# Altium schematic sheet SoM.SchDoc
size A3; DocumentNumber: 4; SheetNumber: 4; SheetTotal: 6; PageSetup: Record=PageOptions|CenterHorizontal=True|CenterVertical=True|PrintScale=0.97|XCorrection=1.00|YCorrection=1.00|PrintKind=1|BorderSize=5000000|LeftOffset=0|BottomOffset=0|Orientation=2|PaperLength=2970|PaperWidth=2100|Scale=100|PaperSource=7|PrintQuality=600|MediaType=1|DitherType=10|PaperKind=A4|PrintScaleMode=1
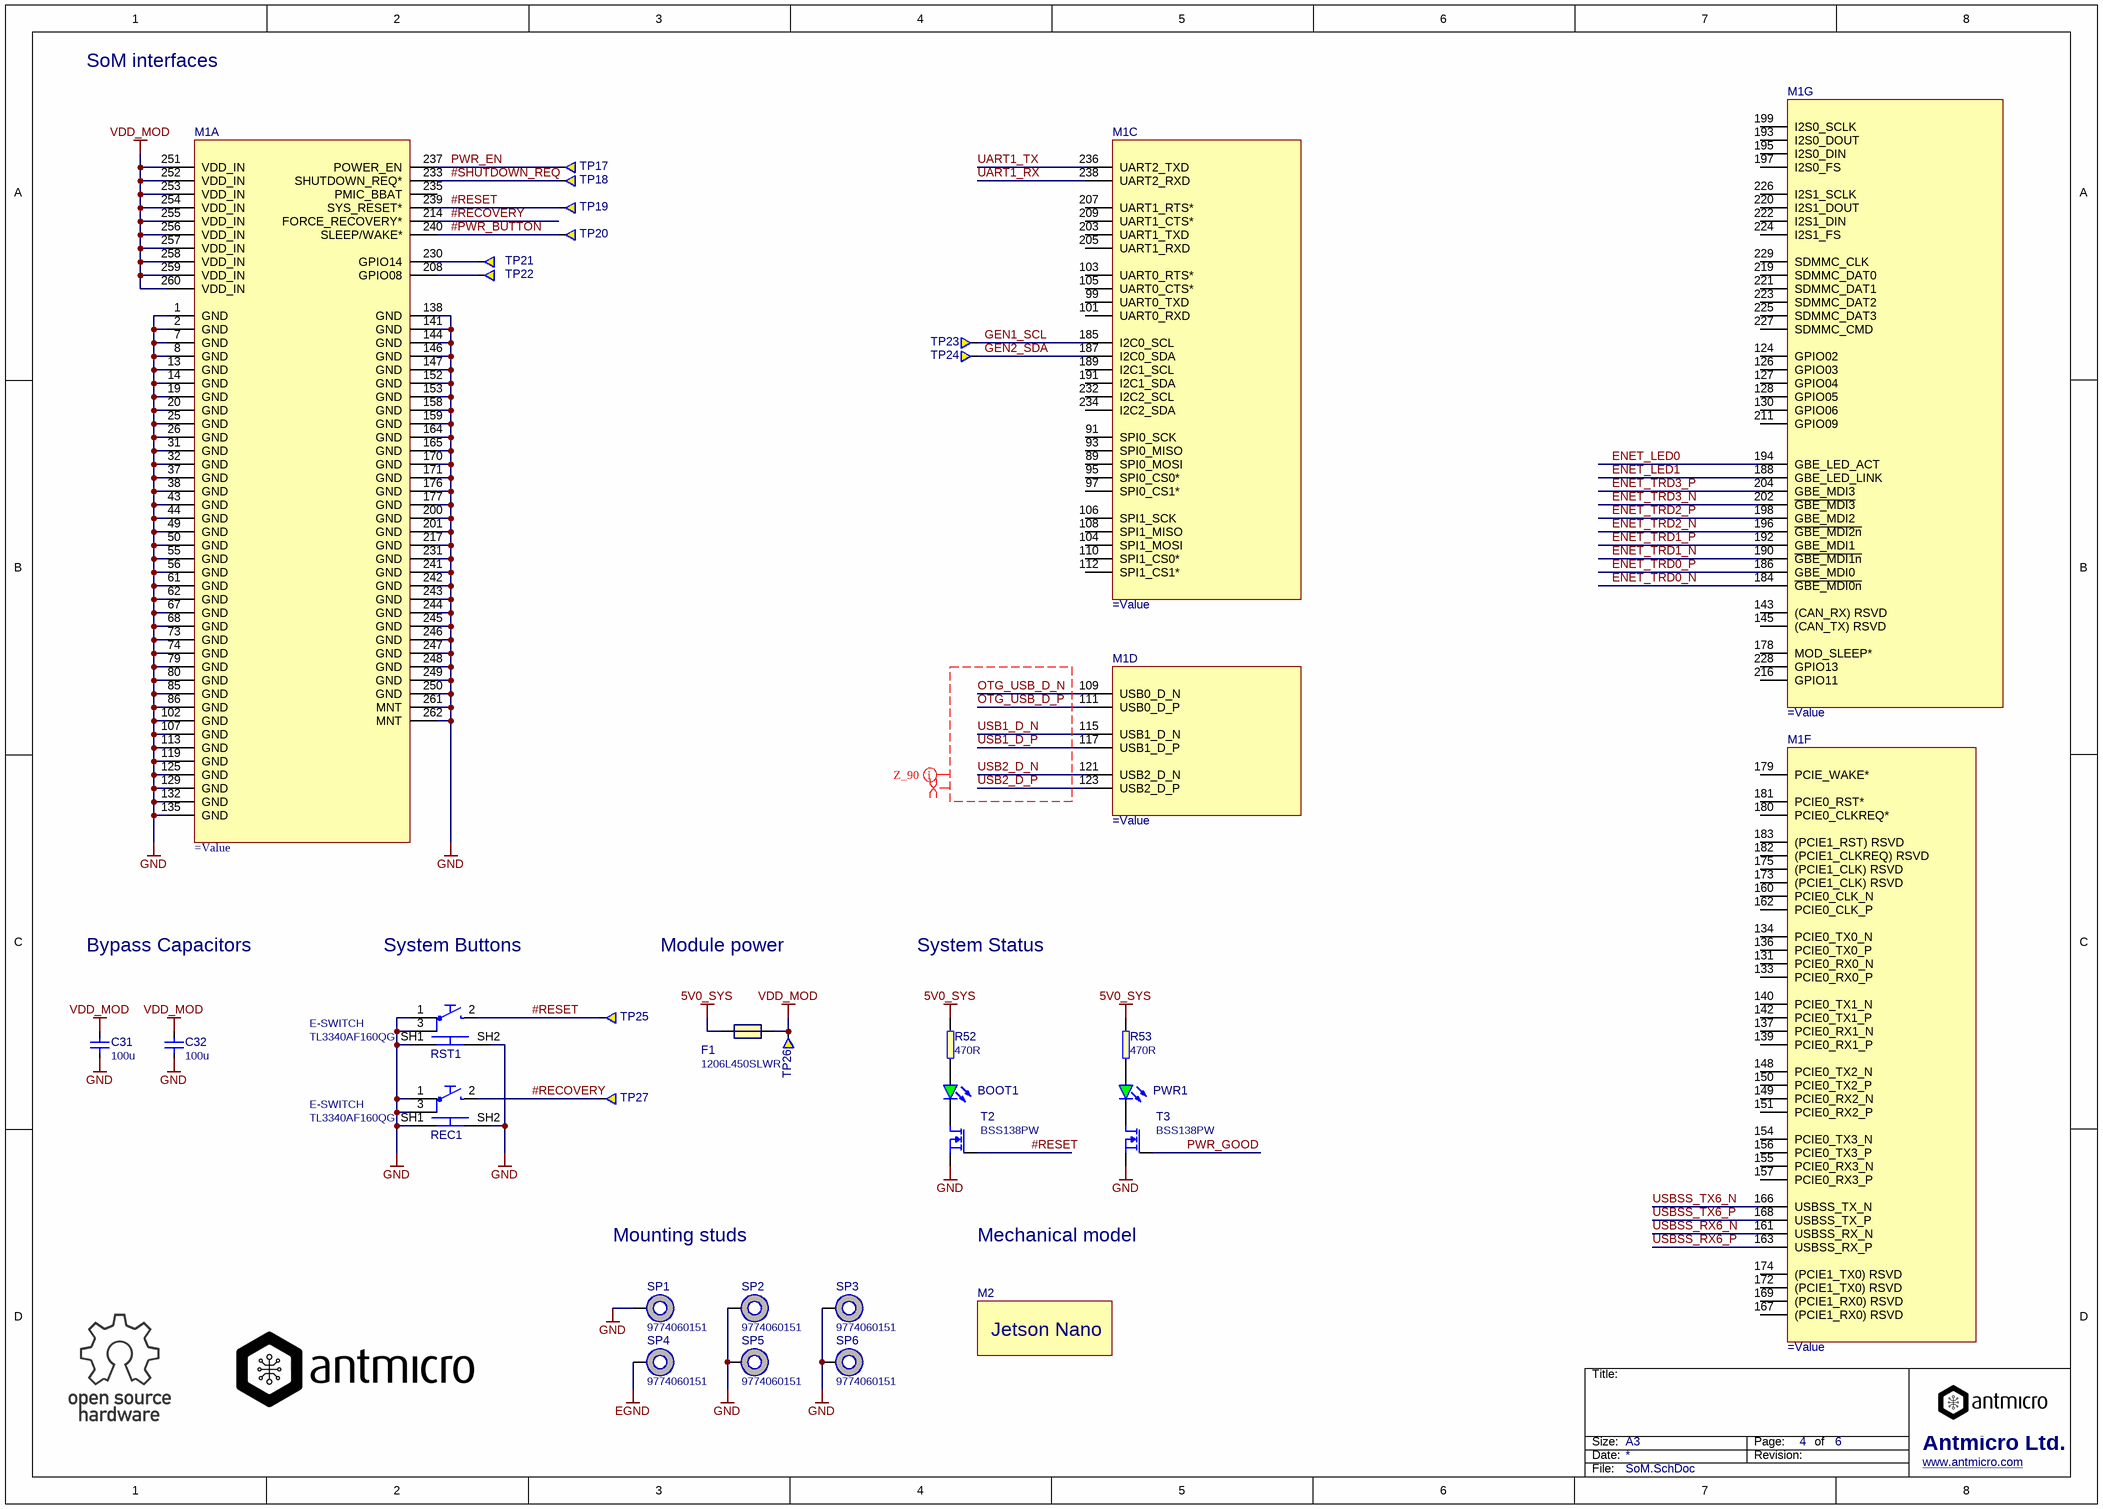
[diagram p0: SoM.SchDoc]

## Parts
BOOT1  KPT-1608SGC  [LED0603]  (value not drawn)
C31  100u  [1206]
C32  100u  [1206]
F1  PartSymbol: 1206L450SLWR  (hidden comment: Value)
M1  (no value)  [jetson-nano-connector]  (parts A,C,D,F,G of 7)
M2  (no value)  [jetson-nano-module]
PWR1  KPT-1608SGC  [LED0603]  (value not drawn)
R52  470R  [0402]
R53  470R  [0402]
REC1  Manufacturer: E-SWITCH  [TL3340AF160QG]  (hidden comment: TL3340AF160QG)
RST1  Manufacturer: E-SWITCH  [TL3340AF160QG]  (hidden comment: TL3340AF160QG)
SP1  9774060151  [M2.5-6mm]
SP2  9774060151  [M2.5-6mm]
SP3  9774060151  [M2.5-6mm]
SP4  9774060151  [M2.5-6mm]
SP5  9774060151  [M2.5-6mm]
SP6  9774060151  [M2.5-6mm]
T2  BSS138PW  [SC70-3]
T3  BSS138PW  [SC70-3]
TP17  Testpad  [TP-R-1.5]  (value not drawn)  (no BOM)
TP18  Testpad  [TP-R-1.5]  (value not drawn)  (no BOM)
TP19  Testpad  [TP-R-1.5]  (value not drawn)  (no BOM)
TP20  Testpad  [TP-R-1.5]  (value not drawn)  (no BOM)
TP21  Testpad  [TP-R-1.5]  (value not drawn)  (no BOM)
TP22  Testpad  [TP-R-1.5]  (value not drawn)  (no BOM)
TP23  Testpad  [TP-R-1.5]  (value not drawn)  (no BOM)
TP24  Testpad  [TP-R-1.5]  (value not drawn)  (no BOM)
TP25  Testpad  [TP-R-1.5]  (value not drawn)  (no BOM)
TP26  Testpad  [TP-R-1.5]  (value not drawn)  (no BOM)
TP27  Testpad  [TP-R-1.5]  (value not drawn)  (no BOM)

## Nets
5V0_SYS: F1.1 R52.2 R53.2
EGND: SP4.1
GND: C31.1 C32.1 M1.1(GND) M1.2(GND) M1.7(GND) M1.8(GND) M1.13(GND) M1.14(GND) M1.19(GND) M1.20(GND) M1.25(GND) M1.26(GND) M1.31(GND) M1.32(GND) M1.37(GND) M1.38(GND) M1.43(GND) M1.44(GND) M1.49(GND) M1.50(GND) M1.55(GND) M1.56(GND) M1.61(GND) M1.62(GND) M1.67(GND) M1.68(GND) M1.73(GND) M1.74(GND) M1.79(GND) M1.80(GND) M1.85(GND) M1.86(GND) M1.102(GND) M1.107(GND) M1.113(GND) M1.119(GND) M1.125(GND) M1.129(GND) M1.132(GND) M1.135(GND) M1.138(GND) M1.141(GND) M1.144(GND) M1.146(GND) M1.147(GND) M1.152(GND) M1.153(GND) M1.158(GND) M1.159(GND) M1.164(GND) M1.165(GND) M1.170(GND) M1.171(GND) M1.176(GND) M1.177(GND) M1.200(GND) M1.201(GND) M1.217(GND) M1.231(GND) M1.241(GND) M1.242(GND) M1.243(GND) M1.244(GND) M1.245(GND) M1.246(GND) M1.247(GND) M1.248(GND) M1.249(GND) M1.250(GND) M1.261(MNT) M1.262(MNT) REC1.1 REC1.3 REC1.SH1 REC1.SH2 RST1.1 RST1.3 RST1.SH1 RST1.SH2 SP1.1 SP2.1 SP3.1 SP5.1 SP6.1 T2.2(S) T3.2(S)
VDD_MOD: C31.2 C32.2 F1.2 M1.251(VDD_IN) M1.252(VDD_IN) M1.253(VDD_IN) M1.254(VDD_IN) M1.255(VDD_IN) M1.256(VDD_IN) M1.257(VDD_IN) M1.258(VDD_IN) M1.259(VDD_IN) M1.260(VDD_IN) TP26.1
#PWR_BUTTON: M1.240(SLEEP/WAKE*) TP20.1
#RECOVERY: M1.214(FORCE_RECOVERY*) REC1.2 TP27.1
#RESET: M1.239(SYS_RESET*) RST1.2 T2.1(G) TP19.1 TP25.1
#SHUTDOWN_REQ: M1.233(SHUTDOWN_REQ*) TP18.1
ENET_LED0: M1.194(GBE_LED_ACT)
ENET_LED1: M1.188(GBE_LED_LINK)
ENET_TRD0_N: M1.184(~{GBE_MDI0n})
ENET_TRD0_P: M1.186(GBE_MDI0)
ENET_TRD1_N: M1.190(~{GBE_MDI1n})
ENET_TRD1_P: M1.192(GBE_MDI1)
ENET_TRD2_N: M1.196(~{GBE_MDI2n})
ENET_TRD2_P: M1.198(GBE_MDI2)
ENET_TRD3_N: M1.202(~{GBE_MDI3})
ENET_TRD3_P: M1.204(GBE_MDI3)
GEN1_SCL: M1.185(I2C0_SCL) TP23.1
GEN2_SDA: M1.187(I2C0_SDA) TP24.1
OTG_USB_D_N: M1.109(USB0_D_N)
OTG_USB_D_P: M1.111(USB0_D_P)
PWR_EN: M1.237(POWER_EN) TP17.1
PWR_GOOD: T3.1(G)
UART1_RX: M1.238(UART2_RXD)
UART1_TX: M1.236(UART2_TXD)
USB1_D_N: M1.115(USB1_D_N)
USB1_D_P: M1.117(USB1_D_P)
USB2_D_N: M1.121(USB2_D_N)
USB2_D_P: M1.123(USB2_D_P)
USBSS_RX6_N: M1.161(USBSS_RX_N)
USBSS_RX6_P: M1.163(USBSS_RX_P)
USBSS_TX6_N: M1.166(USBSS_TX_N)
USBSS_TX6_P: M1.168(USBSS_TX_P)
NetBOOT1_A: BOOT1.A R52.1
NetBOOT1_K: BOOT1.K T2.3(D)
NetM1_208: M1.208(GPIO08) TP22.1
NetM1_230: M1.230(GPIO14) TP21.1
NetPWR1_A: PWR1.A R53.1
NetPWR1_K: PWR1.K T3.3(D)

Not connected (* = marked no-connect by the designer): M1 89(SPI0_MOSI) 91(SPI0_SCK) 93(SPI0_MISO) 95(SPI0_CS0*) 97(SPI0_CS1*) 99(UART0_TXD) 101(UART0_RXD) 103(UART0_RTS*) 104(SPI1_MOSI) 105(UART0_CTS*) 106(SPI1_SCK) 108(SPI1_MISO) 110(SPI1_CS0*) 112(SPI1_CS1*) 124(GPIO02) 126(GPIO03) 127(GPIO04) 128(GPIO05) 130(GPIO06) 131(PCIE0_RX0_N) 133(PCIE0_RX0_P) 134(PCIE0_TX0_N) 136(PCIE0_TX0_P) 137(PCIE0_RX1_N) 139(PCIE0_RX1_P) 140(PCIE0_TX1_N) 142(PCIE0_TX1_P) 143((CAN_RX)_RSVD) 145((CAN_TX)_RSVD) 148(PCIE0_TX2_N) 149(PCIE0_RX2_N) 150(PCIE0_TX2_P) 151(PCIE0_RX2_P) 154(PCIE0_TX3_N) 155(PCIE0_RX3_N) 156(PCIE0_TX3_P) 157(PCIE0_RX3_P) 160(PCIE0_CLK_N) 162(PCIE0_CLK_P) 167((PCIE1_RX0)_RSVD) 169((PCIE1_RX0)_RSVD) 172((PCIE1_TX0)_RSVD) 173((PCIE1_CLK)_RSVD) 174((PCIE1_TX0)_RSVD) 175((PCIE1_CLK)_RSVD) 178(MOD_SLEEP*) 179(PCIE_WAKE*) 180(PCIE0_CLKREQ*) 181(PCIE0_RST*) 182((PCIE1_CLKREQ)_RSVD) 183((PCIE1_RST)_RSVD) 189(I2C1_SCL) 191(I2C1_SDA) 193(I2S0_DOUT) 195(I2S0_DIN) 197(I2S0_FS) 199(I2S0_SCLK) 203(UART1_TXD) 205(UART1_RXD) 207(UART1_RTS*) 209(UART1_CTS*) 211(GPIO09) 216(GPIO11) 219(SDMMC_DAT0) 220(I2S1_DOUT) 221(SDMMC_DAT1) 222(I2S1_DIN) 223(SDMMC_DAT2) 224(I2S1_FS) 225(SDMMC_DAT3) 226(I2S1_SCLK) 227(SDMMC_CMD) 228(GPIO13) 229(SDMMC_CLK) 232(I2C2_SCL) 234(I2C2_SDA) 235(PMIC_BBAT)

## Layout directives
differential pair: OTG_USB_D_N, OTG_USB_D_P, USB1_D_N, USB1_D_P, USB2_D_N, USB2_D_P
net class Z_90: OTG_USB_D_N, OTG_USB_D_P, USB1_D_N, USB1_D_P, USB2_D_N, USB2_D_P

## Notes on the sheet
- SoM interfaces
- Bypass Capacitors
- System Buttons
- Module power
- System Status
- Mounting studs
- Mechanical model
- Title:
- Size:
- Date:
- A3
- Revision:
- Page:
- of
- Antmicro Ltd.
- File:
- www.antmicro.com
- (in symbol jetson-nano-module) Jetson Nano

## Library data of the parts
BOOT1 PWR1 = LED: LED Green 0603 case; PartNumber: LED_G; Manufacturer: KINGBRIGHT; Value: KPT-1608SGC; PartSymbol: KPT-1608SGC
C31 C32 = C_100u_1206: MLCC SMT Capacitor 100uF 1206; Manufacturer: VISHAY; PartSymbol: TMCMA0J107MTRF; PartNumber: C_100u_1206; Value: 100u
F1 = Fuse: PTC RESET 6V LO RHO 1206 4.50A; PartNumber: LITTELFUSE_1206L450SLWR; Manufacturer: LITTELFUSE; Value: 1206L450SLWR
M1 = Jetson-Nano-new-release: PartNumber: jetson-nano-new-release
M2 = jetson-nano-module: PartNumber: jetson-nano-module
R52 R53 = R_470R_0402: RES, 470R, 0402; Manufacturer: VISHAY; PartSymbol: CRCW0402470RFKED.; PartNumber: R_470R_0402; Value: 470R
REC1 RST1 = TL3340AF160QG: E-SWITCH  TL3340AF160QG  SWITCH, TACTILE SPST 50mA, SMD GULL WING; Value: TL3340AF160QG; PartNumber: TL3340AF160QG; PartSymbol: TL3340AF160QG
SP1-SP6 = SPACER: M2.5-6mm; PartNumber: M2.5x6; Manufacturer: WURTH ELEKTRONIK; Value: 9774060151; PartSymbol: 9774060151
T2 T3 = NMOS: MOSFET, N CH, 60V, 0.2A; Manufacturer: NXP; Value: BSS138PW; PartNumber: BSS138PW; PartSymbol: BSS138PW
TP17-TP27 = Testpad: Testpad, round, 1.5mm; PartNumber: TP-R-1.5